# Altium schematic sheet Connector.SchDoc: Connector
size A4; Author: Jose Luis Llorente Gonzalez; CompanyName: ETSIT; Organization: UPM; Revision: V1.0
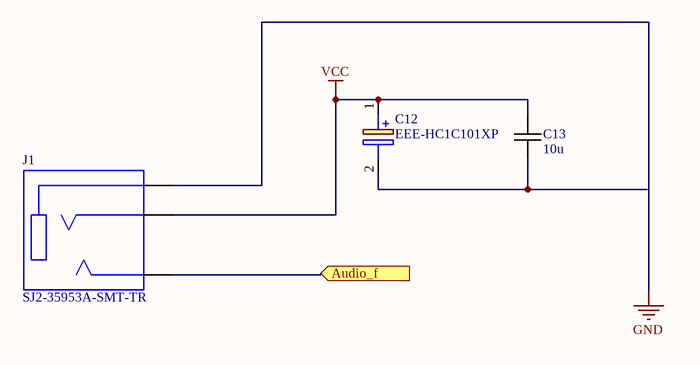
[diagram p0: Connector.SchDoc]

## Parts
C12  EEE-HC1C101XP  [CAPAE660X800N]
C13  10u  [0805C-GENERIC]
J1  SJ2-35953A-SMT-TR  [CUI_SJ2-35953A-SMT-TR]

## Ports
Audio_f (in)

## Nets
GND: J1.1(SLEEVE)
VCC: C12.1(+) C13.1 J1.3(RING1)
Audio_f: J1.2(TIP) ; port Audio_f
NetC12_2: C12.2(-) C13.2

## Notes on the sheet
- Title
- Size:
- Date:
- A4
- Number:
- Time:
- Revision:
- Sheet
- of
- File:

## Library data of the parts
C12 = EEE-HC1C101XP: Capacitor Polarised; Manufacturer_Name: Panasonic; Allied_Number: 70258549; Datasheet Link: http://industrial.panasonic.com/www-cgi/jvcr13pz.cgi?E+PZ+3+ABA0109+EEEHC1C101XP+7+WW; Height: 8mm; Manufacturer_Part_Number: EEE-HC1C101XP; Mouser Part Number: 667-EEE-HC1C101XP; Mouser Price/Stock: https://www.mouser.com/Search/Refine.aspx?Keyword=667-EEE-HC1C101XP; Allied Price/Stock: https://www.alliedelec.com/panasonic-eee-hc1c101xp/70258549/
C13 = C0805-GENERIC: GENERIC CAPACITOR NON POLARISED0603
J1 = SJ2-35953A-SMT-TR: 3.5 mm, Stereo, Right Angle, Surface Mount _SMT_, Audio Jack Connector; MF: CUI Devices; Price: None; Availability: Unavailable; SnapEDA_Link: https://www.snapeda.com/parts/SJ2-35953A-SMT-TR/CUI%20Devices/view-part/701771/?ref=snap; MP: SJ2-35953A-SMT-TR; CUI_purchase_URL: https://www.cuidevices.com/product/interconnect/connectors/audio-connectors/jacks/sj2-3595x-smt-series?utm_source=snapeda.com&utm_medium=referral&utm_campaign=snapedaBOM; Value: *; Package: None